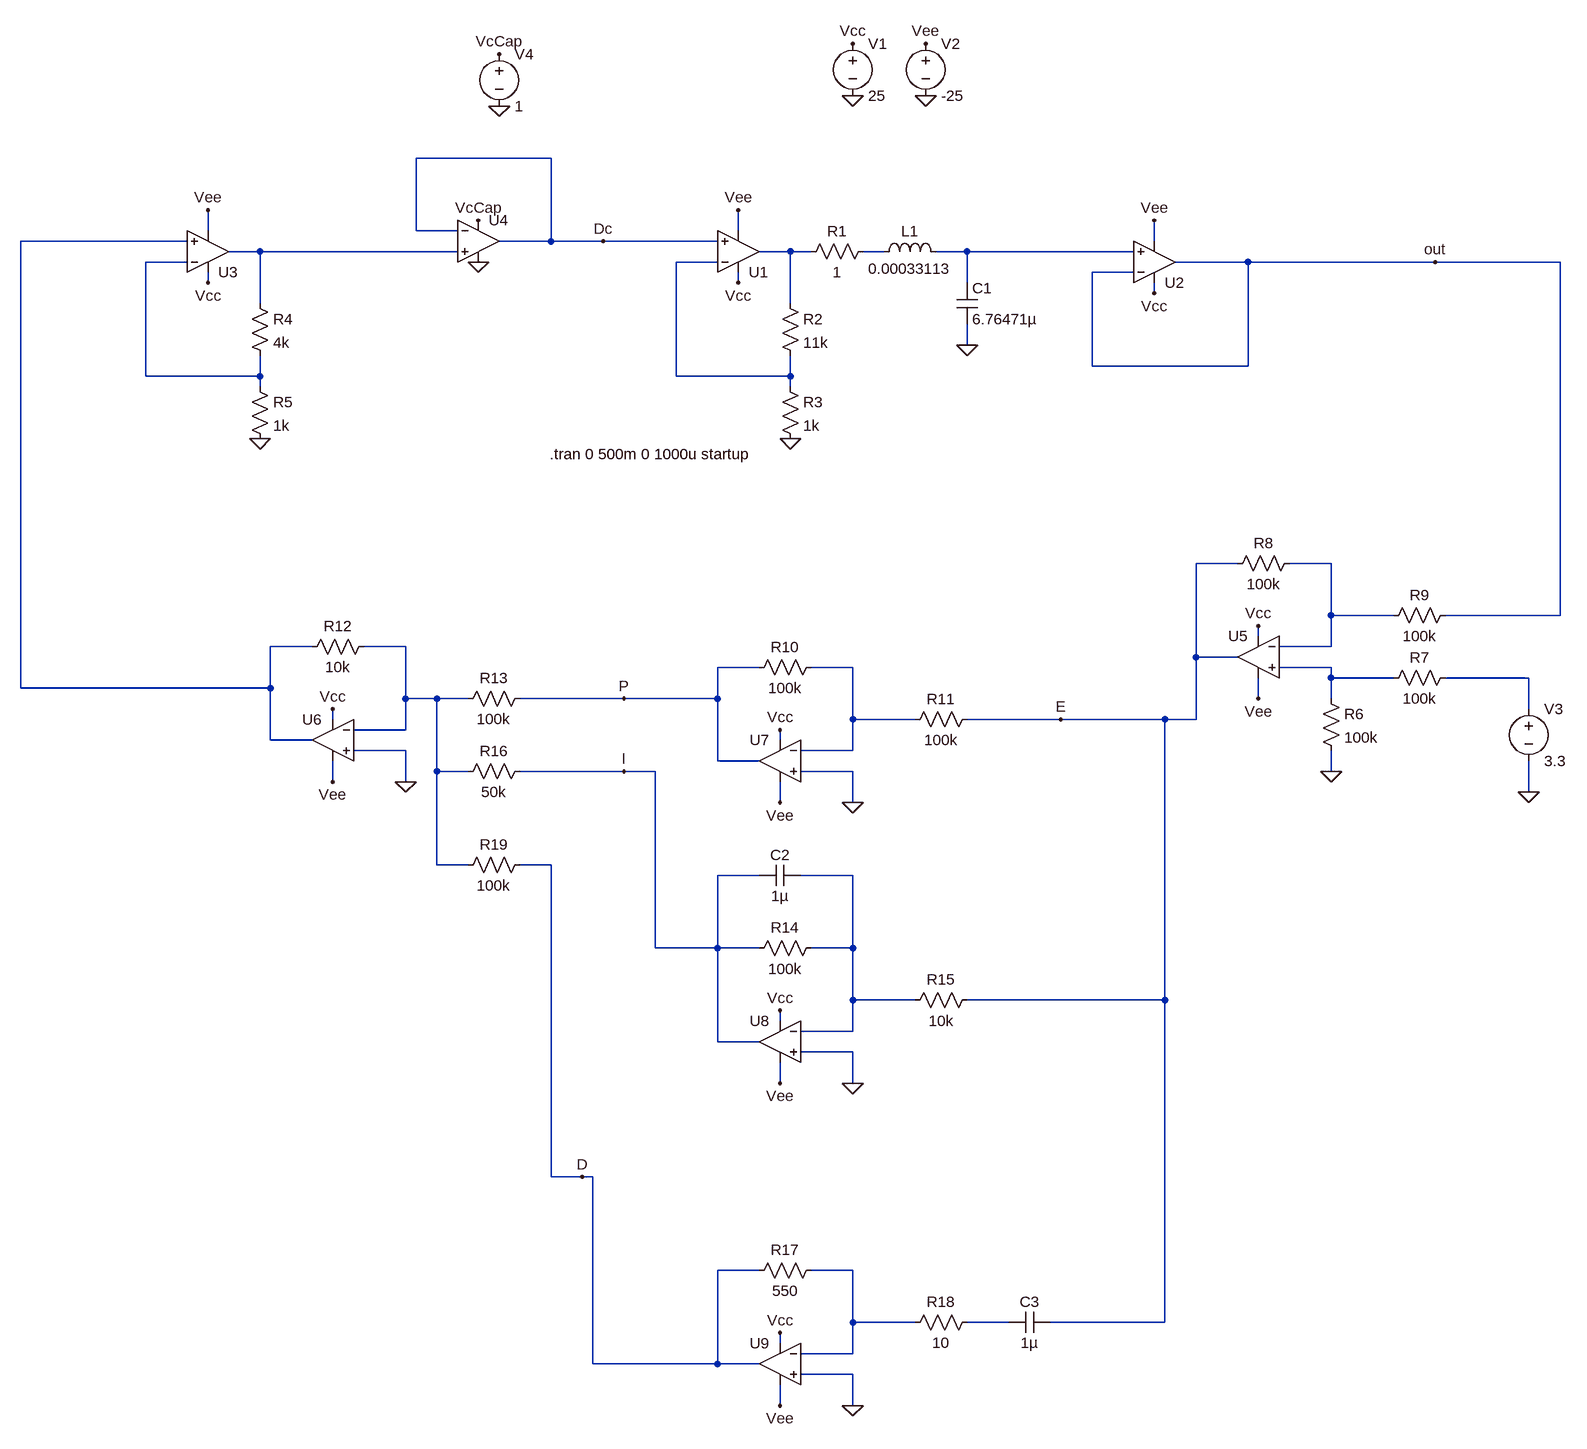
[diagram p0: schematic PID_BUCK.asc]
PID_BUCK.asc, the LTspice schematic file:
Version 4
SHEET 1 1200 2008
WIRE -368 0 -576 0
WIRE -896 112 -896 80
WIRE -576 112 -576 0
WIRE -512 112 -576 112
WIRE -80 112 -80 80
WIRE -928 128 -1184 128
WIRE -368 128 -368 0
WIRE -368 128 -448 128
WIRE -288 128 -368 128
WIRE -112 128 -288 128
WIRE 560 128 560 96
WIRE -816 144 -864 144
WIRE -512 144 -816 144
WIRE 0 144 -48 144
WIRE 32 144 0 144
WIRE 144 144 112 144
WIRE 272 144 224 144
WIRE 528 144 272 144
WIRE -928 160 -992 160
WIRE -112 160 -176 160
WIRE 704 160 592 160
WIRE 992 160 704 160
WIRE 1184 160 992 160
WIRE 528 176 464 176
WIRE -896 192 -896 176
WIRE -80 192 -80 176
WIRE 272 192 272 144
WIRE 560 208 560 192
WIRE -816 224 -816 144
WIRE 0 224 0 144
WIRE 272 288 272 256
WIRE 464 320 464 176
WIRE 704 320 704 160
WIRE 704 320 464 320
WIRE -992 336 -992 160
WIRE -816 336 -816 304
WIRE -816 336 -992 336
WIRE -176 336 -176 160
WIRE 0 336 0 304
WIRE 0 336 -176 336
WIRE -816 352 -816 336
WIRE 0 352 0 336
WIRE 688 624 624 624
WIRE 832 624 768 624
WIRE 832 704 832 624
WIRE 928 704 832 704
WIRE 1184 704 1184 160
WIRE 1184 704 1008 704
WIRE 720 736 720 720
WIRE -736 752 -800 752
WIRE -592 752 -656 752
WIRE 832 752 832 704
WIRE 832 752 752 752
WIRE 624 768 624 624
WIRE 688 768 624 768
WIRE -48 784 -112 784
WIRE 96 784 32 784
WIRE 832 784 752 784
WIRE 832 800 832 784
WIRE 928 800 832 800
WIRE 1136 800 1008 800
WIRE -1184 816 -1184 128
WIRE -800 816 -800 752
WIRE -800 816 -1184 816
WIRE -592 832 -592 752
WIRE -544 832 -592 832
WIRE -496 832 -544 832
WIRE -256 832 -416 832
WIRE -112 832 -112 784
WIRE -112 832 -256 832
WIRE 720 832 720 800
WIRE 832 832 832 800
WIRE 1136 848 1136 800
WIRE -704 864 -704 848
WIRE 96 864 96 784
WIRE 192 864 96 864
WIRE 416 864 272 864
WIRE 576 864 416 864
WIRE 624 864 624 768
WIRE 624 864 576 864
WIRE -592 880 -592 832
WIRE -592 880 -672 880
WIRE -800 896 -800 816
WIRE -736 896 -800 896
WIRE -16 896 -16 880
WIRE -592 912 -672 912
WIRE 96 912 96 864
WIRE 96 912 16 912
WIRE -112 928 -112 832
WIRE -48 928 -112 928
WIRE -544 944 -544 832
WIRE -496 944 -544 944
WIRE -256 944 -416 944
WIRE -208 944 -256 944
WIRE 96 944 16 944
WIRE 832 944 832 912
WIRE -704 960 -704 928
WIRE -592 960 -592 912
WIRE 1136 976 1136 928
WIRE -16 992 -16 960
WIRE 96 992 96 944
WIRE -544 1088 -544 944
WIRE -496 1088 -544 1088
WIRE -368 1088 -416 1088
WIRE -48 1104 -112 1104
WIRE 96 1104 16 1104
WIRE -208 1216 -208 944
WIRE -112 1216 -112 1104
WIRE -112 1216 -208 1216
WIRE -48 1216 -112 1216
WIRE 96 1216 96 1104
WIRE 96 1216 32 1216
WIRE 96 1296 96 1216
WIRE 192 1296 96 1296
WIRE 576 1296 576 864
WIRE 576 1296 272 1296
WIRE -16 1328 -16 1312
WIRE 96 1344 96 1296
WIRE 96 1344 16 1344
WIRE -112 1360 -112 1216
WIRE -48 1360 -112 1360
WIRE 96 1376 16 1376
WIRE -16 1424 -16 1392
WIRE 96 1424 96 1376
WIRE -368 1568 -368 1088
WIRE -320 1568 -368 1568
WIRE -304 1568 -320 1568
WIRE -48 1712 -112 1712
WIRE 96 1712 32 1712
WIRE 96 1792 96 1712
WIRE 192 1792 96 1792
WIRE 336 1792 272 1792
WIRE 576 1792 576 1296
WIRE 576 1792 400 1792
WIRE -16 1824 -16 1808
WIRE 96 1840 96 1792
WIRE 96 1840 16 1840
WIRE -304 1856 -304 1568
WIRE -112 1856 -112 1712
WIRE -112 1856 -304 1856
WIRE -48 1856 -112 1856
WIRE 96 1872 16 1872
WIRE -16 1920 -16 1888
WIRE 96 1920 96 1872
FLAG 272 288 0
FLAG -80 192 Vcc
FLAG -80 80 Vee
FLAG 0 432 0
FLAG 560 208 Vcc
FLAG 560 96 Vee
FLAG 96 -96 0
FLAG 208 -96 0
FLAG 208 -176 Vee
FLAG 96 -176 Vcc
FLAG -448 -80 0
FLAG -448 -160 VcCap
FLAG -480 96 VcCap
FLAG -480 160 0
FLAG -896 192 Vcc
FLAG -896 80 Vee
FLAG -816 432 0
FLAG 720 720 Vcc
FLAG 720 832 Vee
FLAG 832 944 0
FLAG 1136 976 0
FLAG -704 848 Vcc
FLAG -704 960 Vee
FLAG -592 960 0
FLAG -16 880 Vcc
FLAG -16 992 Vee
FLAG 96 992 0
FLAG -16 1312 Vcc
FLAG -16 1424 Vee
FLAG 96 1424 0
FLAG -16 1808 Vcc
FLAG -16 1920 Vee
FLAG 96 1920 0
FLAG 416 864 E
FLAG -256 832 P
FLAG -256 944 I
FLAG -320 1568 D
FLAG -288 128 Dc
FLAG 992 160 out
SYMBOL ind 128 160 R270
WINDOW 0 32 56 VTop 2
WINDOW 3 5 56 VBottom 2
SYMATTR InstName L1
SYMATTR Value 0.00033113
SYMBOL res 128 128 R90
WINDOW 0 0 56 VBottom 2
WINDOW 3 32 56 VTop 2
SYMATTR InstName R1
SYMATTR Value 1
SYMBOL cap 256 192 R0
SYMATTR InstName C1
SYMATTR Value 6.76471µ
SYMBOL OpAmps\\UniversalOpamp2 -80 144 M180
SYMATTR InstName U1
SYMBOL res -16 208 R0
SYMATTR InstName R2
SYMATTR Value 11k
SYMBOL res -16 336 R0
SYMATTR InstName R3
SYMATTR Value 1k
SYMBOL OpAmps\\UniversalOpamp2 560 160 M180
SYMATTR InstName U2
SYMBOL voltage 96 -192 R0
WINDOW 123 0 0 Left 0
WINDOW 39 0 0 Left 0
SYMATTR InstName V1
SYMATTR Value 25
SYMBOL voltage 208 -192 R0
WINDOW 123 0 0 Left 0
WINDOW 39 0 0 Left 0
SYMATTR InstName V2
SYMATTR Value -25
SYMBOL voltage -448 -176 R0
WINDOW 123 0 0 Left 0
WINDOW 39 0 0 Left 0
SYMATTR InstName V4
SYMATTR Value 1
SYMBOL OpAmps\\UniversalOpamp2 -480 128 R0
SYMATTR InstName U4
SYMBOL OpAmps\\UniversalOpamp2 -896 144 M180
SYMATTR InstName U3
SYMBOL res -832 208 R0
SYMATTR InstName R4
SYMATTR Value 4k
SYMBOL res -832 336 R0
SYMATTR InstName R5
SYMATTR Value 1k
SYMBOL OpAmps\\UniversalOpamp2 720 768 M0
SYMATTR InstName U5
SYMBOL res 816 816 R0
SYMATTR InstName R6
SYMATTR Value 100k
SYMBOL res 1024 784 R90
WINDOW 0 0 56 VBottom 2
WINDOW 3 32 56 VTop 2
SYMATTR InstName R7
SYMATTR Value 100k
SYMBOL res 784 608 R90
WINDOW 0 0 56 VBottom 2
WINDOW 3 32 56 VTop 2
SYMATTR InstName R8
SYMATTR Value 100k
SYMBOL res 1024 688 R90
WINDOW 0 0 56 VBottom 2
WINDOW 3 32 56 VTop 2
SYMATTR InstName R9
SYMATTR Value 100k
SYMBOL voltage 1136 832 R0
WINDOW 123 0 0 Left 0
WINDOW 39 0 0 Left 0
SYMATTR InstName V3
SYMATTR Value 3.3
SYMBOL OpAmps\\UniversalOpamp2 -704 896 M0
SYMATTR InstName U6
SYMBOL res -640 736 R90
WINDOW 0 0 56 VBottom 2
WINDOW 3 32 56 VTop 2
SYMATTR InstName R12
SYMATTR Value 10k
SYMBOL res -400 816 R90
WINDOW 0 0 56 VBottom 2
WINDOW 3 32 56 VTop 2
SYMATTR InstName R13
SYMATTR Value 100k
SYMBOL OpAmps\\UniversalOpamp2 -16 928 M0
SYMATTR InstName U7
SYMBOL res 48 768 R90
WINDOW 0 0 56 VBottom 2
WINDOW 3 32 56 VTop 2
SYMATTR InstName R10
SYMATTR Value 100k
SYMBOL res 288 848 R90
WINDOW 0 0 56 VBottom 2
WINDOW 3 32 56 VTop 2
SYMATTR InstName R11
SYMATTR Value 100k
SYMBOL OpAmps\\UniversalOpamp2 -16 1360 M0
SYMATTR InstName U8
SYMBOL res 48 1200 R90
WINDOW 0 0 56 VBottom 2
WINDOW 3 32 56 VTop 2
SYMATTR InstName R14
SYMATTR Value 100k
SYMBOL res 288 1280 R90
WINDOW 0 0 56 VBottom 2
WINDOW 3 32 56 VTop 2
SYMATTR InstName R15
SYMATTR Value 10k
SYMBOL cap 16 1088 R90
WINDOW 0 0 32 VBottom 2
WINDOW 3 32 32 VTop 2
SYMATTR InstName C2
SYMATTR Value 1µ
SYMBOL res -400 928 R90
WINDOW 0 0 56 VBottom 2
WINDOW 3 32 56 VTop 2
SYMATTR InstName R16
SYMATTR Value 50k
SYMBOL OpAmps\\UniversalOpamp2 -16 1856 M0
SYMATTR InstName U9
SYMBOL res 48 1696 R90
WINDOW 0 0 56 VBottom 2
WINDOW 3 32 56 VTop 2
SYMATTR InstName R17
SYMATTR Value 550
SYMBOL res 288 1776 R90
WINDOW 0 0 56 VBottom 2
WINDOW 3 32 56 VTop 2
SYMATTR InstName R18
SYMATTR Value 10
SYMBOL cap 400 1776 R90
WINDOW 0 0 32 VBottom 2
WINDOW 3 32 32 VTop 2
SYMATTR InstName C3
SYMATTR Value 1µ
SYMBOL res -400 1072 R90
WINDOW 0 0 56 VBottom 2
WINDOW 3 32 56 VTop 2
SYMATTR InstName R19
SYMATTR Value 100k
TEXT -370 456 Left 2 !.tran 0 500m 0 1000u startup

The netlist it stands for:
* PID_BUCK.asc
L1 N004 N005 0.00033113
R1 N004 N003 1
C1 N005 0 6.76471µ
XU1 Dc N007 Vcc Vee N003 level.2 Avol=1Meg GBW=10Meg Slew=10Meg ilimit=25m rail=0 Vos=0 phimargin=45 en=0 enk=0 in=0 ink=0 Rin=500Meg  ; pins IN+ IN- V+ V- OUT
R2 N003 N007 11k
R3 N007 0 1k
XU2 N005 out Vcc Vee out level.2 Avol=1Meg GBW=10Meg Slew=10Meg ilimit=25m rail=0 Vos=0 phimargin=45 en=0 enk=0 in=0 ink=0 Rin=500Meg  ; pins IN+ IN- V+ V- OUT
V1 Vcc 0 25
V2 Vee 0 -25
V4 VcCap 0 1
XU4 N002 Dc VcCap 0 Dc level.2 Avol=1Meg GBW=10Meg Slew=10Meg ilimit=25m rail=0 Vos=0 phimargin=45 en=0 enk=0 in=0 ink=0 Rin=500Meg  ; pins IN+ IN- V+ V- OUT
XU3 N001 N006 Vcc Vee N002 level.2 Avol=1Meg GBW=10Meg Slew=10Meg ilimit=25m rail=0 Vos=0 phimargin=45 en=0 enk=0 in=0 ink=0 Rin=500Meg  ; pins IN+ IN- V+ V- OUT
R4 N002 N006 4k
R5 N006 0 1k
XU5 N011 N008 Vcc Vee E level.2 Avol=1Meg GBW=10Meg Slew=10Meg ilimit=25m rail=0 Vos=0 phimargin=45 en=0 enk=0 in=0 ink=0 Rin=500Meg  ; pins IN+ IN- V+ V- OUT
R6 N011 0 100k
R7 N012 N011 100k
R8 N008 E 100k
R9 out N008 100k
V3 N012 0 3.3
XU6 0 N009 Vcc Vee N001 level.2 Avol=1Meg GBW=10Meg Slew=10Meg ilimit=25m rail=0 Vos=0 phimargin=45 en=0 enk=0 in=0 ink=0 Rin=500Meg  ; pins IN+ IN- V+ V- OUT
R12 N009 N001 10k
R13 P N009 100k
XU7 0 N010 Vcc Vee P level.2 Avol=1Meg GBW=10Meg Slew=10Meg ilimit=25m rail=0 Vos=0 phimargin=45 en=0 enk=0 in=0 ink=0 Rin=500Meg  ; pins IN+ IN- V+ V- OUT
R10 N010 P 100k
R11 E N010 100k
XU8 0 N013 Vcc Vee I level.2 Avol=1Meg GBW=10Meg Slew=10Meg ilimit=25m rail=0 Vos=0 phimargin=45 en=0 enk=0 in=0 ink=0 Rin=500Meg  ; pins IN+ IN- V+ V- OUT
R14 N013 I 100k
R15 E N013 10k
C2 N013 I 1µ
R16 I N009 50k
XU9 0 N014 Vcc Vee D level.2 Avol=1Meg GBW=10Meg Slew=10Meg ilimit=25m rail=0 Vos=0 phimargin=45 en=0 enk=0 in=0 ink=0 Rin=500Meg  ; pins IN+ IN- V+ V- OUT
R17 N014 D 550
R18 N015 N014 10
C3 E N015 1µ
R19 D N009 100k
.tran 0 500m 0 1000u startup
.lib UniversalOpamps2.sub
.backanno
.end